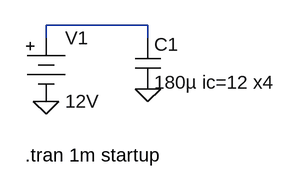
[diagram p0: schematic Draft1.asc]
Draft1.asc, the LTspice schematic file:
Version 4
SHEET 1 880 680
WIRE 208 144 80 144
WIRE 80 160 80 144
WIRE 208 160 208 144
FLAG 208 224 0
FLAG 80 240 0
SYMBOL cap 192 160 R0
SYMATTR InstName C1
SYMATTR Value 180µ ic=12 x4
SYMBOL Misc\\battery 80 144 R0
WINDOW 123 0 0 Left 0
WINDOW 39 24 132 Left 2
SYMATTR InstName V1
SYMATTR Value 12V
TEXT 54 308 Left 2 !.tran 1m startup

The netlist it stands for:
* Draft1.asc
C1 N001 0 180µ ic=12 x4
V1 N001 0 12V
.tran 1m startup
.backanno
.end